# EAGLE design gamingpack (EAGLE 5.10)

## Sheet 1 of 2
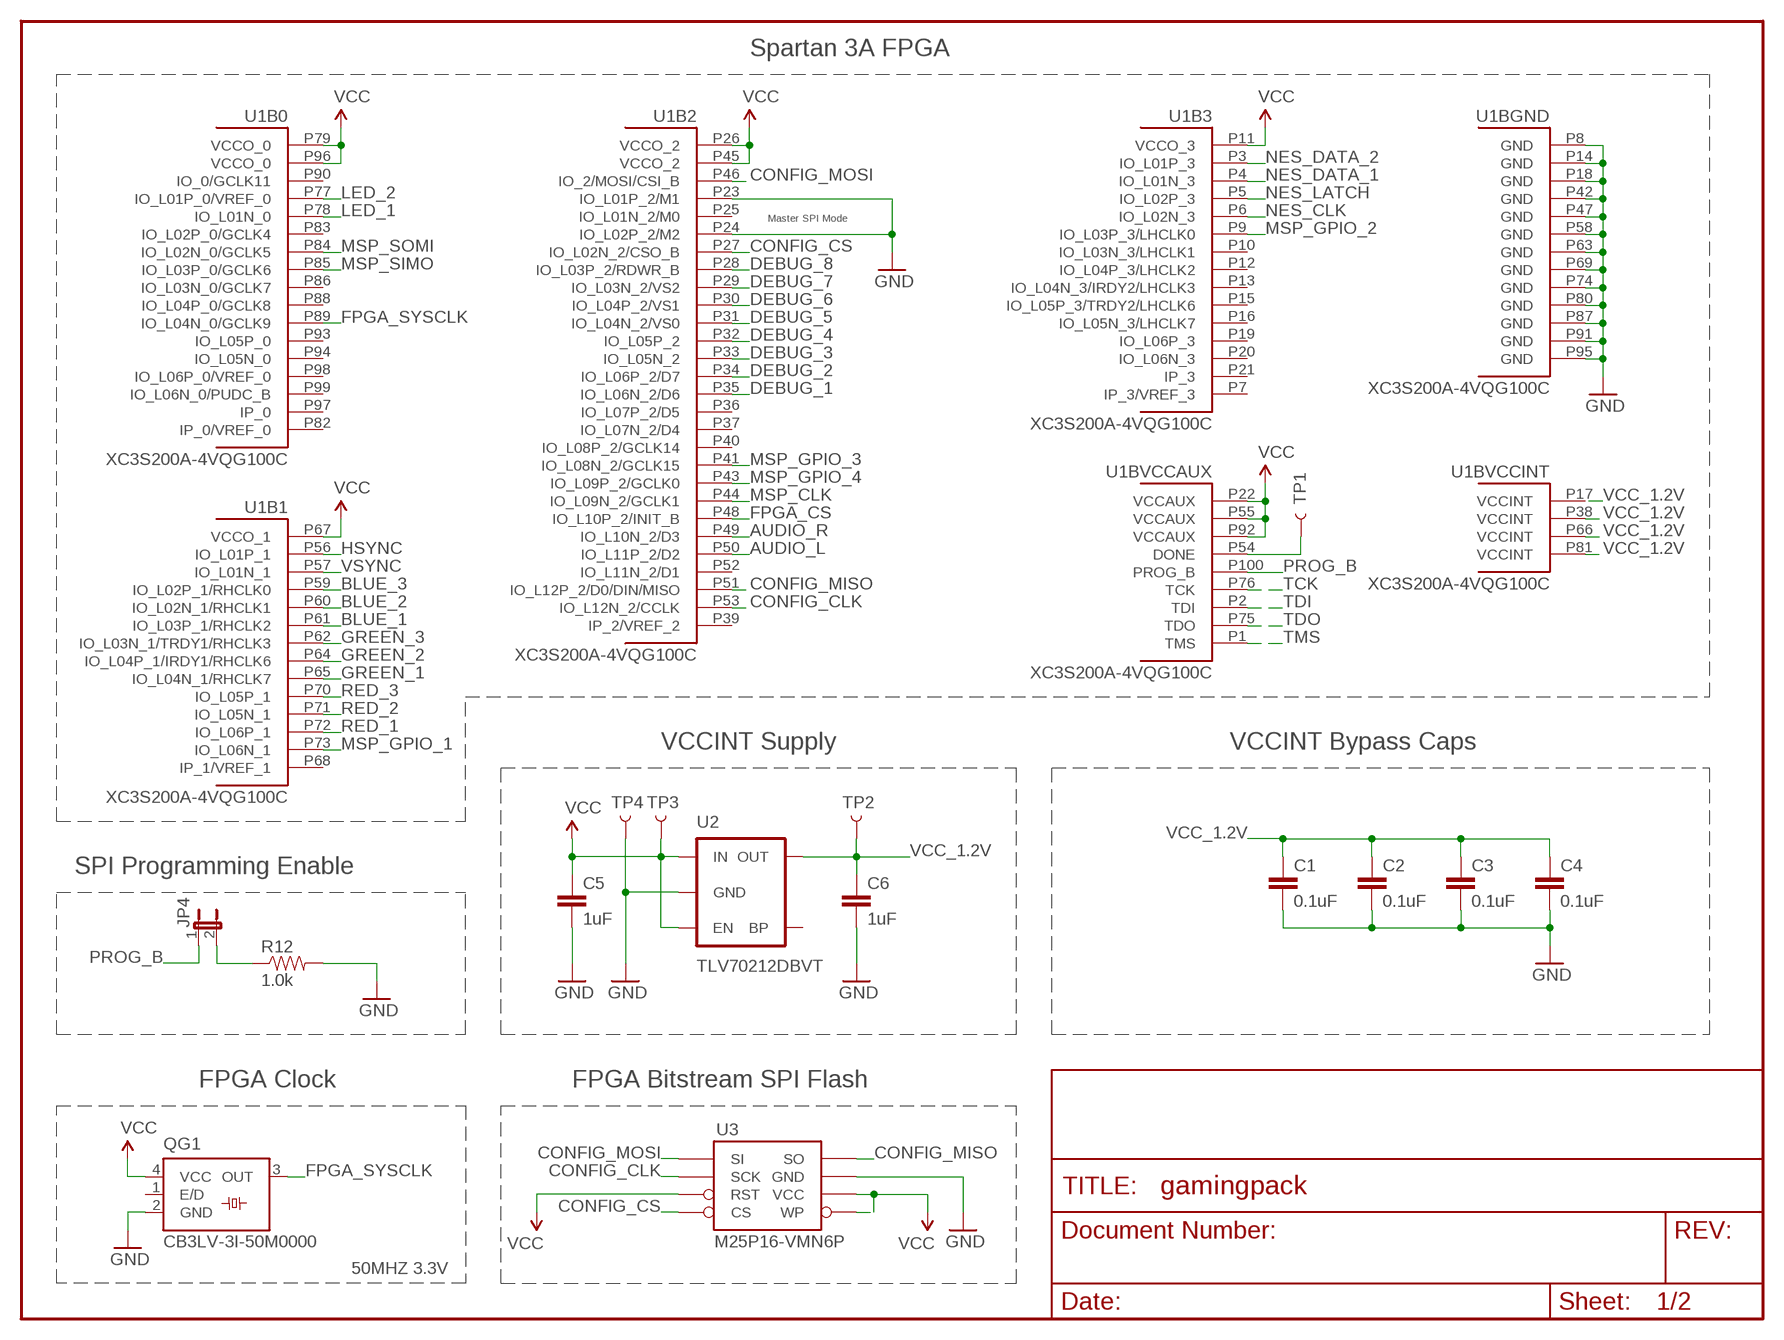
[diagram p0: schematic, sheet 1]

### Parts
C1  0.1uF  CAP0603-CAP  [0603-CAP]
C2  0.1uF  CAP0603-CAP  [0603-CAP]
C3  0.1uF  CAP0603-CAP  [0603-CAP]
C4  0.1uF  CAP0603-CAP  [0603-CAP]
C5  1uF  CAP0603-CAP  [0603-CAP]
C6  1uF  CAP0603-CAP  [0603-CAP]
JP4  JUMPER-2PTH  [1X02]
QG1  CB3LV-3I-50M0000  SM77H  [SM77H]
R12  1.0k  RESISTOR0805-RES  [0805]
TP1  TEST-POINT3  [PAD.03X.03]
TP2  TEST-POINT3  [PAD.03X.03]
TP3  TEST-POINT3  [PAD.03X.03]
TP4  TEST-POINT3  [PAD.03X.03]
U1  XC3S200A-4VQG100C  XC3S200AVQ100  [VQ100]
U2  TLV70212DBVT  V_REG_LDOSMD  [SOT23-5]
U3  M25P16-VMN6P  M25PXNARROW  [SO08]

### Nets
AUDIO_L: U1.P50(B2:IO_L11P_2/D2) ; also sheet 2
AUDIO_R: U1.P49(B2:IO_L10N_2/D3) ; also sheet 2
BLUE_1: U1.P61(B1:IO_L03P_1/RHCLK2) ; also sheet 2
BLUE_2: U1.P60(B1:IO_L02N_1/RHCLK1) ; also sheet 2
BLUE_3: U1.P59(B1:IO_L02P_1/RHCLK0) ; also sheet 2
CONFIG_CLK: U1.P53(B2:IO_L12N_2/CCLK) U3.6(SCK) ; also sheet 2
CONFIG_CS: U1.P27(B2:IO_L02N_2/CSO_B) U3.1(CS) ; also sheet 2
CONFIG_MISO: U1.P51(B2:IO_L12P_2/D0/DIN/MISO) U3.2(SO) ; also sheet 2
CONFIG_MOSI: U1.P46(B2:IO_2/MOSI/CSI_B) U3.5(SI) ; also sheet 2
DEBUG_1: U1.P35(B2:IO_L06N_2/D6) ; also sheet 2
DEBUG_2: U1.P34(B2:IO_L06P_2/D7) ; also sheet 2
DEBUG_3: U1.P33(B2:IO_L05N_2) ; also sheet 2
DEBUG_4: U1.P32(B2:IO_L05P_2) ; also sheet 2
DEBUG_5: U1.P31(B2:IO_L04N_2/VS0) ; also sheet 2
DEBUG_6: U1.P30(B2:IO_L04P_2/VS1) ; also sheet 2
DEBUG_7: U1.P29(B2:IO_L03N_2/VS2) ; also sheet 2
DEBUG_8: U1.P28(B2:IO_L03P_2/RDWR_B) ; also sheet 2
FPGA_CS: U1.P48(B2:IO_L10P_2/INIT_B) ; also sheet 2
FPGA_SYSCLK: QG1.3(OUT) U1.P89(B0:IO_L04N_0/GCLK9)
GND: C1.2 C2.2 C3.2 C4.2 C5.2 C6.2 QG1.2(GND) R12.2 TP4.P$1 U1.P8(BGND:GND) U1.P14(BGND:GND) U1.P18(BGND:GND) U1.P23(B2:IO_L01P_2/M1) U1.P24(B2:IO_L02P_2/M2) U1.P42(BGND:GND) U1.P47(BGND:GND) U1.P58(BGND:GND) U1.P63(BGND:GND) U1.P69(BGND:GND) U1.P74(BGND:GND) U1.P80(BGND:GND) U1.P87(BGND:GND) U1.P91(BGND:GND) U1.P95(BGND:GND) U2.2(GND) U3.4(GND) ; also sheet 2
GREEN_1: U1.P65(B1:IO_L04N_1/RHCLK7) ; also sheet 2
GREEN_2: U1.P64(B1:IO_L04P_1/IRDY1/RHCLK6) ; also sheet 2
GREEN_3: U1.P62(B1:IO_L03N_1/TRDY1/RHCLK3) ; also sheet 2
HSYNC: U1.P56(B1:IO_L01P_1) ; also sheet 2
LED_1: U1.P78(B0:IO_L01N_0) ; also sheet 2
LED_2: U1.P77(B0:IO_L01P_0/VREF_0) ; also sheet 2
MSP_CLK: U1.P44(B2:IO_L09N_2/GCLK1) ; also sheet 2
MSP_GPIO_1: U1.P73(B1:IO_L06N_1) ; also sheet 2
MSP_GPIO_2: U1.P9(B3:IO_L03P_3/LHCLK0) ; also sheet 2
MSP_GPIO_3: U1.P41(B2:IO_L08N_2/GCLK15) ; also sheet 2
MSP_GPIO_4: U1.P43(B2:IO_L09P_2/GCLK0) ; also sheet 2
MSP_SIMO: U1.P85(B0:IO_L03P_0/GCLK6) ; also sheet 2
MSP_SOMI: U1.P84(B0:IO_L02N_0/GCLK5) ; also sheet 2
N$7: JP4.2 R12.1
N$11: TP1.P$1 U1.P54(BVCCAUX:DONE)
NES_CLK: U1.P6(B3:IO_L02N_3) ; also sheet 2
NES_DATA_1: U1.P4(B3:IO_L01N_3) ; also sheet 2
NES_DATA_2: U1.P3(B3:IO_L01P_3) ; also sheet 2
NES_LATCH: U1.P5(B3:IO_L02P_3) ; also sheet 2
PROG_B: JP4.1 U1.P100(BVCCAUX:PROG_B)
RED_1: U1.P72(B1:IO_L06P_1) ; also sheet 2
RED_2: U1.P71(B1:IO_L05N_1) ; also sheet 2
RED_3: U1.P70(B1:IO_L05P_1) ; also sheet 2
TCK: U1.P76(BVCCAUX:TCK) ; also sheet 2
TDI: U1.P2(BVCCAUX:TDI) ; also sheet 2
TDO: U1.P75(BVCCAUX:TDO) ; also sheet 2
TMS: U1.P1(BVCCAUX:TMS) ; also sheet 2
VCC: C5.1 QG1.4(VCC) TP3.P$1 U1.P11(B3:VCCO_3) U1.P22(BVCCAUX:VCCAUX) U1.P26(B2:VCCO_2) U1.P45(B2:VCCO_2) U1.P55(BVCCAUX:VCCAUX) U1.P67(B1:VCCO_1) U1.P79(B0:VCCO_0) U1.P92(BVCCAUX:VCCAUX) U1.P96(B0:VCCO_0) U2.1(IN) U2.3(EN) U3.3(WP) U3.7(RST) U3.8(VCC) ; also sheet 2
VCC_1.2V: C1.1 C2.1 C3.1 C4.1 C6.1 TP2.P$1 U1.P17(BVCCINT:VCCINT) U1.P38(BVCCINT:VCCINT) U1.P66(BVCCINT:VCCINT) U1.P81(BVCCINT:VCCINT) U2.5(OUT)
VSYNC: U1.P57(B1:IO_L01N_1) ; also sheet 2
Unconnected: QG1.1(E/D) U1.P7(B3:IP_3/VREF_3) U1.P10(B3:IO_L03N_3/LHCLK1) U1.P12(B3:IO_L04P_3/LHCLK2) U1.P13(B3:IO_L04N_3/IRDY2/LHCLK3) U1.P15(B3:IO_L05P_3/TRDY2/LHCLK6) U1.P16(B3:IO_L05N_3/LHCLK7) U1.P19(B3:IO_L06P_3) U1.P20(B3:IO_L06N_3) U1.P21(B3:IP_3) U1.P25(B2:IO_L01N_2/M0) U1.P36(B2:IO_L07P_2/D5) U1.P37(B2:IO_L07N_2/D4) U1.P39(B2:IP_2/VREF_2) U1.P40(B2:IO_L08P_2/GCLK14) U1.P52(B2:IO_L11N_2/D1) U1.P68(B1:IP_1/VREF_1) U1.P82(B0:IP_0/VREF_0) U1.P83(B0:IO_L02P_0/GCLK4) U1.P86(B0:IO_L03N_0/GCLK7) U1.P88(B0:IO_L04P_0/GCLK8) U1.P90(B0:IO_0/GCLK11) U1.P93(B0:IO_L05P_0) U1.P94(B0:IO_L05N_0) U1.P97(B0:IP_0) U1.P98(B0:IO_L06P_0/VREF_0) U1.P99(B0:IO_L06N_0/PUDC_B) U2.4(BP)

### Notes on the sheet
- Spartan 3A FPGA
- Master SPI Mode
- VCCINT Supply | VCCINT Bypass Caps
- SPI Programming Enable
- FPGA Clock | FPGA Bitstream SPI Flash
- M25P16-VMN6P
- 50MHZ 3.3V

## Sheet 2 of 2
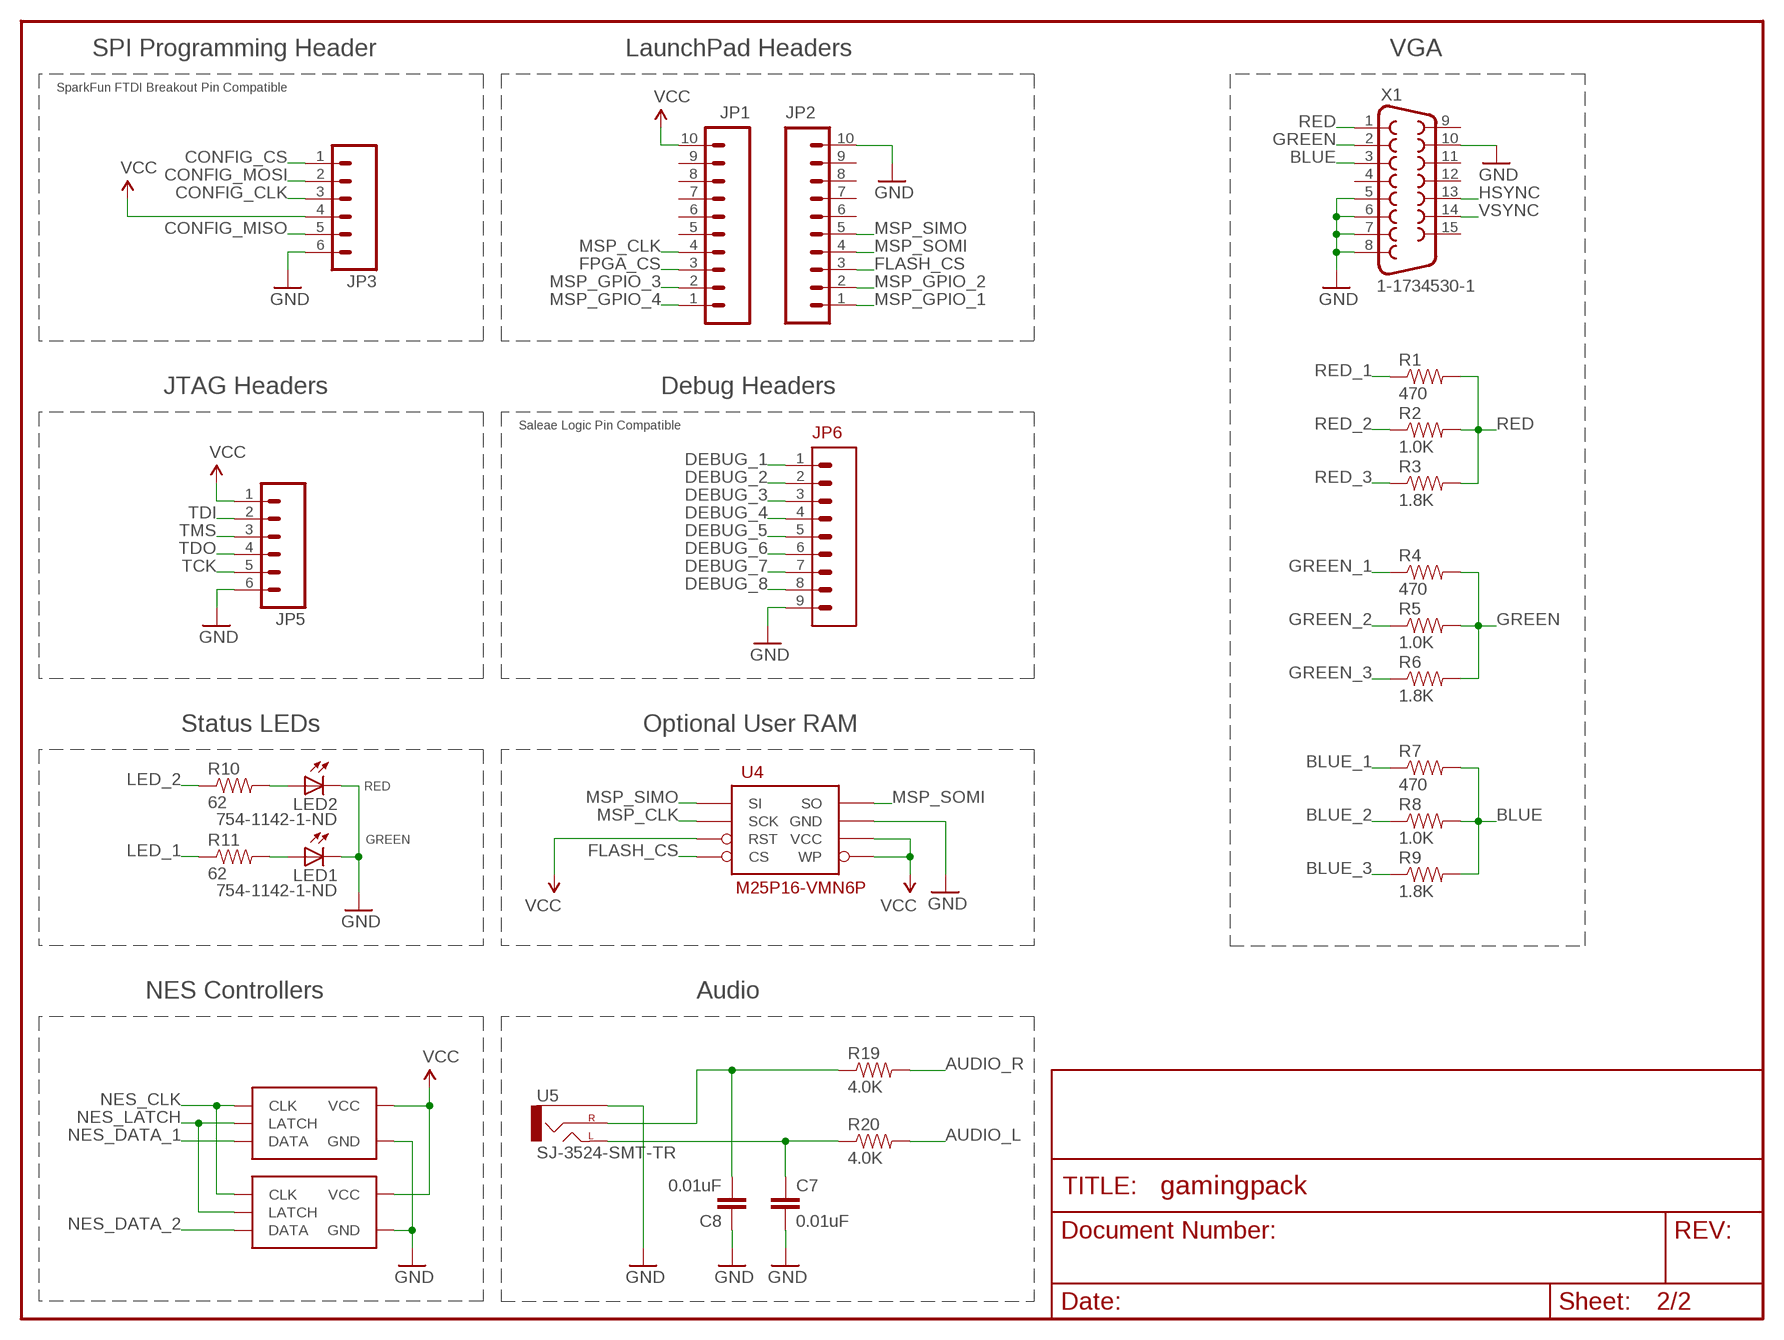
[diagram p1: schematic, sheet 2]

### Parts
C7  0.01uF  CAP0603-CAP  [0603-CAP]
C8  0.01uF  CAP0603-CAP  [0603-CAP]
JP1  M10"  [1X10]
JP2  M10"  [1X10]
JP3  M06SIP  [1X06]
JP5  M06SIP  [1X06]
JP6  M09_SMD  [1X09-SMD]
LED1  754-1142-1-ND  LED1206  [LED-1206]
LED2  754-1142-1-ND  LED1206  [LED-1206]
R1  470  RESISTOR0805-RES  [0805]
R2  1.0K  RESISTOR0805-RES  [0805]
R3  1.8K  RESISTOR0805-RES  [0805]
R4  470  RESISTOR0805-RES  [0805]
R5  1.0K  RESISTOR0805-RES  [0805]
R6  1.8K  RESISTOR0805-RES  [0805]
R7  470  RESISTOR0805-RES  [0805]
R8  1.0K  RESISTOR0805-RES  [0805]
R9  1.8K  RESISTOR0805-RES  [0805]
R10  62  RESISTOR0805-RES  [0805]
R11  62  RESISTOR0805-RES  [0805]
R19  4.0K  RESISTOR0805-RES  [0805]
R20  4.0K  RESISTOR0805-RES  [0805]
U4  M25P16-VMN6P  M25PXNARROW  [SO08]
U5  SJ-3524-SMT-TR  AUDIO-JACKSMD2  [AUDIO-JACK-3.5MM-SMD]
U$2  NES_CONTROLLER  [NES_CONTROLLER]
U$3  NES_CONTROLLER  [NES_CONTROLLER]
X1  1-1734530-1  F15HDH  [HDF15H]

### Nets
AUDIO_L: R20.2 ; also sheet 1
AUDIO_R: R19.2 ; also sheet 1
BLUE: R7.2 R8.2 R9.2 X1.3
BLUE_1: R7.1 ; also sheet 1
BLUE_2: R8.1 ; also sheet 1
BLUE_3: R9.1 ; also sheet 1
CONFIG_CLK: JP3.3 ; also sheet 1
CONFIG_CS: JP3.1 ; also sheet 1
CONFIG_MISO: JP3.5 ; also sheet 1
CONFIG_MOSI: JP3.2 ; also sheet 1
DEBUG_1: JP6.1 ; also sheet 1
DEBUG_2: JP6.2 ; also sheet 1
DEBUG_3: JP6.3 ; also sheet 1
DEBUG_4: JP6.4 ; also sheet 1
DEBUG_5: JP6.5 ; also sheet 1
DEBUG_6: JP6.6 ; also sheet 1
DEBUG_7: JP6.7 ; also sheet 1
DEBUG_8: JP6.8 ; also sheet 1
FLASH_CS: JP2.3 U4.1(CS)
FPGA_CS: JP1.3 ; also sheet 1
GND: C7.2 C8.1 JP2.10 JP3.6 JP5.6 JP6.9 LED1.C LED2.C U4.4(GND) U5.SLEEVE U$2.P$1(GND) U$3.P$1(GND) X1.5 X1.6 X1.7 X1.8 X1.10 ; also sheet 1
GREEN: R4.2 R5.2 R6.2 X1.2
GREEN_1: R4.1 ; also sheet 1
GREEN_2: R5.1 ; also sheet 1
GREEN_3: R6.1 ; also sheet 1
HSYNC: X1.13 ; also sheet 1
LED_1: R11.1 ; also sheet 1
LED_2: R10.1 ; also sheet 1
MSP_CLK: JP1.4 U4.6(SCK) ; also sheet 1
MSP_GPIO_1: JP2.1 ; also sheet 1
MSP_GPIO_2: JP2.2 ; also sheet 1
MSP_GPIO_3: JP1.2 ; also sheet 1
MSP_GPIO_4: JP1.1 ; also sheet 1
MSP_SIMO: JP2.5 U4.5(SI) ; also sheet 1
MSP_SOMI: JP2.4 U4.2(SO) ; also sheet 1
N$1: LED2.A R10.2
N$2: LED1.A R11.2
N$5: C8.2 R19.1 U5.RING(RIGHT)
N$19: C7.1 R20.1 U5.TIP(LEFT)
NES_CLK: U$2.P$2(CLK) U$3.P$2(CLK) ; also sheet 1
NES_DATA_1: U$2.P$4(DATA) ; also sheet 1
NES_DATA_2: U$3.P$4(DATA) ; also sheet 1
NES_LATCH: U$2.P$3(LATCH) U$3.P$3(LATCH) ; also sheet 1
RED: R1.2 R2.2 R3.2 X1.1
RED_1: R1.1 ; also sheet 1
RED_2: R2.1 ; also sheet 1
RED_3: R3.1 ; also sheet 1
TCK: JP5.5 ; also sheet 1
TDI: JP5.2 ; also sheet 1
TDO: JP5.4 ; also sheet 1
TMS: JP5.3 ; also sheet 1
VCC: JP1.10 JP3.4 JP5.1 U4.3(WP) U4.7(RST) U4.8(VCC) U$2.P$7(VCC) U$3.P$7(VCC) ; also sheet 1
VSYNC: X1.14 ; also sheet 1
Unconnected: JP1.5 JP1.6 JP1.7 JP1.8 JP1.9 JP2.6 JP2.7 JP2.8 JP2.9 X1.4 X1.9 X1.11 X1.12 X1.15

### Notes on the sheet
- SPI Programming Header | LaunchPad Headers | VGA
- SparkFun FTDI Breakout Pin Compatible
- JTAG Headers | Debug Headers
- Saleae Logic Pin Compatible
- Status LEDs | Optional User RAM
- RED
- GREEN
- NES Controllers | Audio

## Library data of the parts
C1-C8 = SparkFun:CAP: Capacitor Standard 0603 ceramic capacitor, and 0.1" leaded capacitor.
JP1 JP2 = SparkFun:M10: Header 10 Standard 10-pin 0.1" header. Use with straight break away headers (SKU : PRT-00116), right angle break away headers (PRT-00553), swiss pins (PRT-00743), machine pins (PRT-00117), and female headers (PRT-00115).
JP3 JP5 = SparkFun:M06: Header 6 Standard 6-pin 0.1" header. Use with straight break away headers (SKU : PRT-00116), right angle break away headers (PRT-00553), swiss pins (PRT-00743), machine pins (PRT-00117), and female headers (PRT-00115). Molex polarized connector foot print use with SKU : PRT-08094 with associated crimp pins and housings. NOTES ON THE VARIANTS LOCK and LOCK_LONGPADS... This footprint was designed to help hold the alignment of a through-hole component (i.e. 6-pin header) while soldering it into place. You may notice that each hole has been shifted either up or down by 0.005 of an inch from it's more standard position (which is a perfectly straight line). This slight alteration caused the pins (the squares in the middle) to touch the edges of the holes. Because they are alternating, it causes a "brace" to hold the component in place. 0.005 has proven to be the perfect amount of "off-center" position when using our standard breakaway headers. Although looks a little odd when you look at the bare footprint, once you have a header in there, the alteration is very hard to notice. Also, if you push a header all the way into place, it is covered up entirely on the bottom side. This idea of altering the position of holes to aid alignment will be further integrated into the Sparkfun Library for other footprints. It can help hold any component with 3 or more connection pins.
JP4 = SparkFun:JUMPER-2: Jumper Basic 0.1" spaced jumper. Use with breakaway headers.
JP6 = smd_pin_headers:M09_SMD
LED1 LED2 = SparkFun:LED: LEDs Standard schematic elements and footprints for 5mm, 3mm, 1206, and 0603 sized LEDs. 5mm - Spark Fun Electronics SKU : COM-00529 (and others)
QG1 = crystal:SM77H: 3.3V CMOS Clock Oscillator Source: www.pletronics.com .. sm77h%203.3v.pdf
R1-R12 R19 R20 = SparkFun:RESISTOR: Resistor Basic schematic elements and footprints for 0603, 1206, and PTH resistors.
TP1-TP4 = SparkFun:TEST-POINT
U1 = xilinx_devices:XC3S200AVQ100: Xilinx FPGA: XC3S200AVQ100
U2 = SparkFun:V_REG_LDO: Voltage Regulator LDO Standard 150mA LDO voltage regulator in SOT-23 layout. Micrel part MIC5205. BP (by-pass) pin is used to lower output noise with 470pF cap.
U3 U4 = m25p_spi_prom:M25PX
U5 = SparkFun:AUDIO-JACK: 3.5mm Audio Jack Simple 3.5mm common PCB mount audio jack. SKU: PRT-08032
U$2 U$3 = nes_controller:NES_CONTROLLER
X1 = db15_connectors:F15: SUB-D HDH is also known as a right angle VGA' connector'

## Board
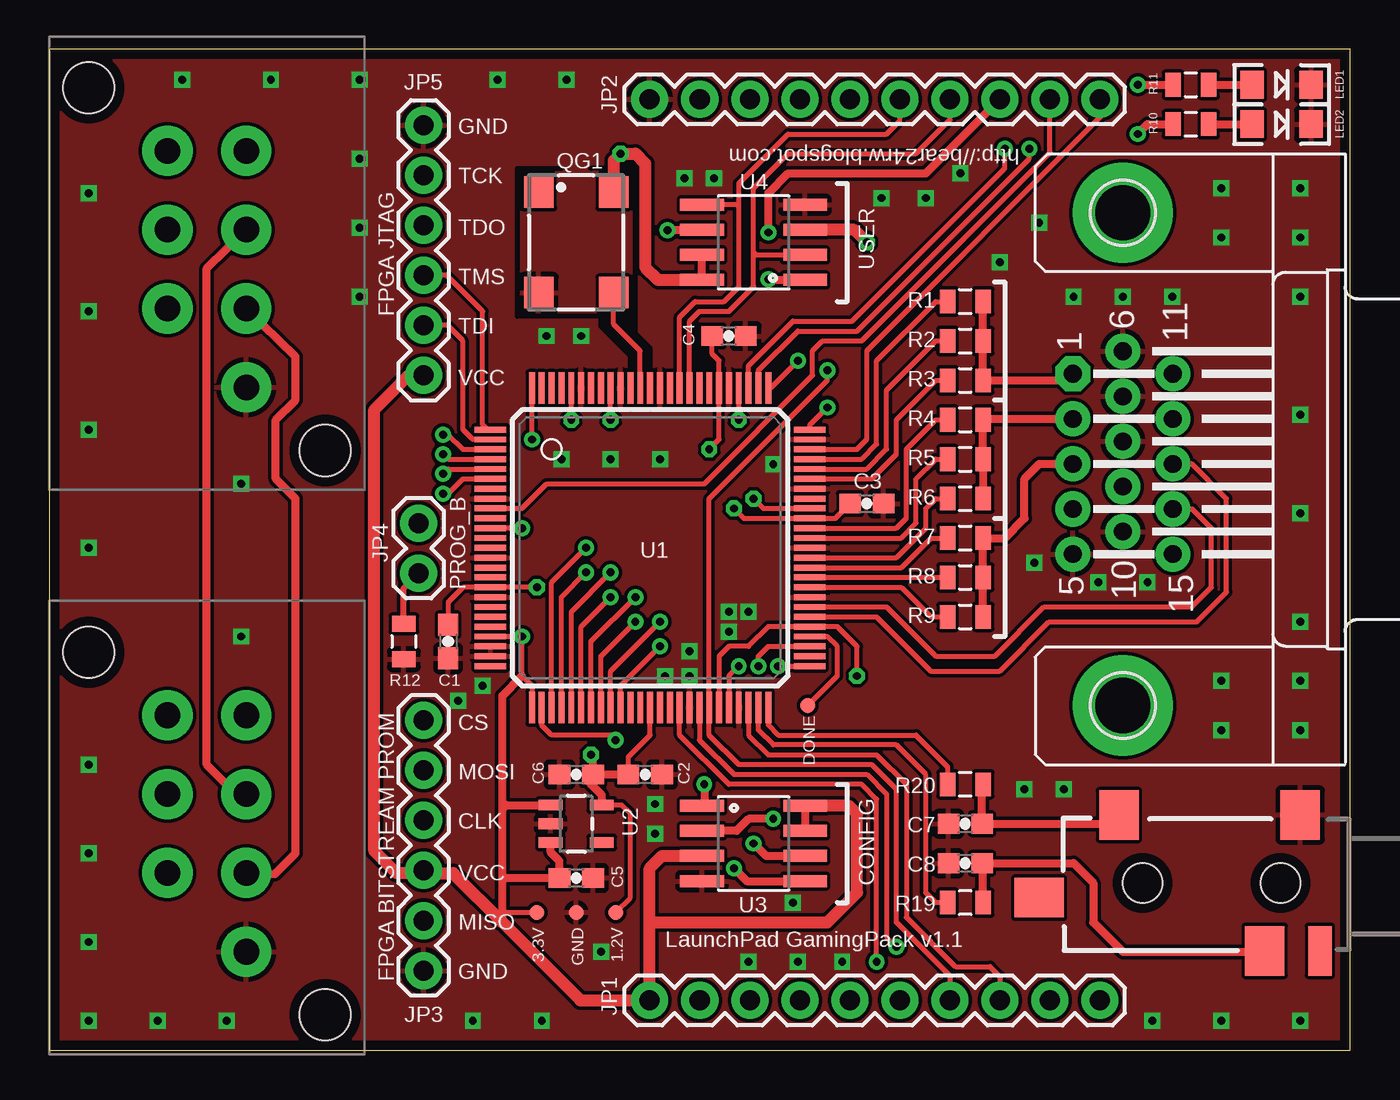
[diagram p2: board, top side]
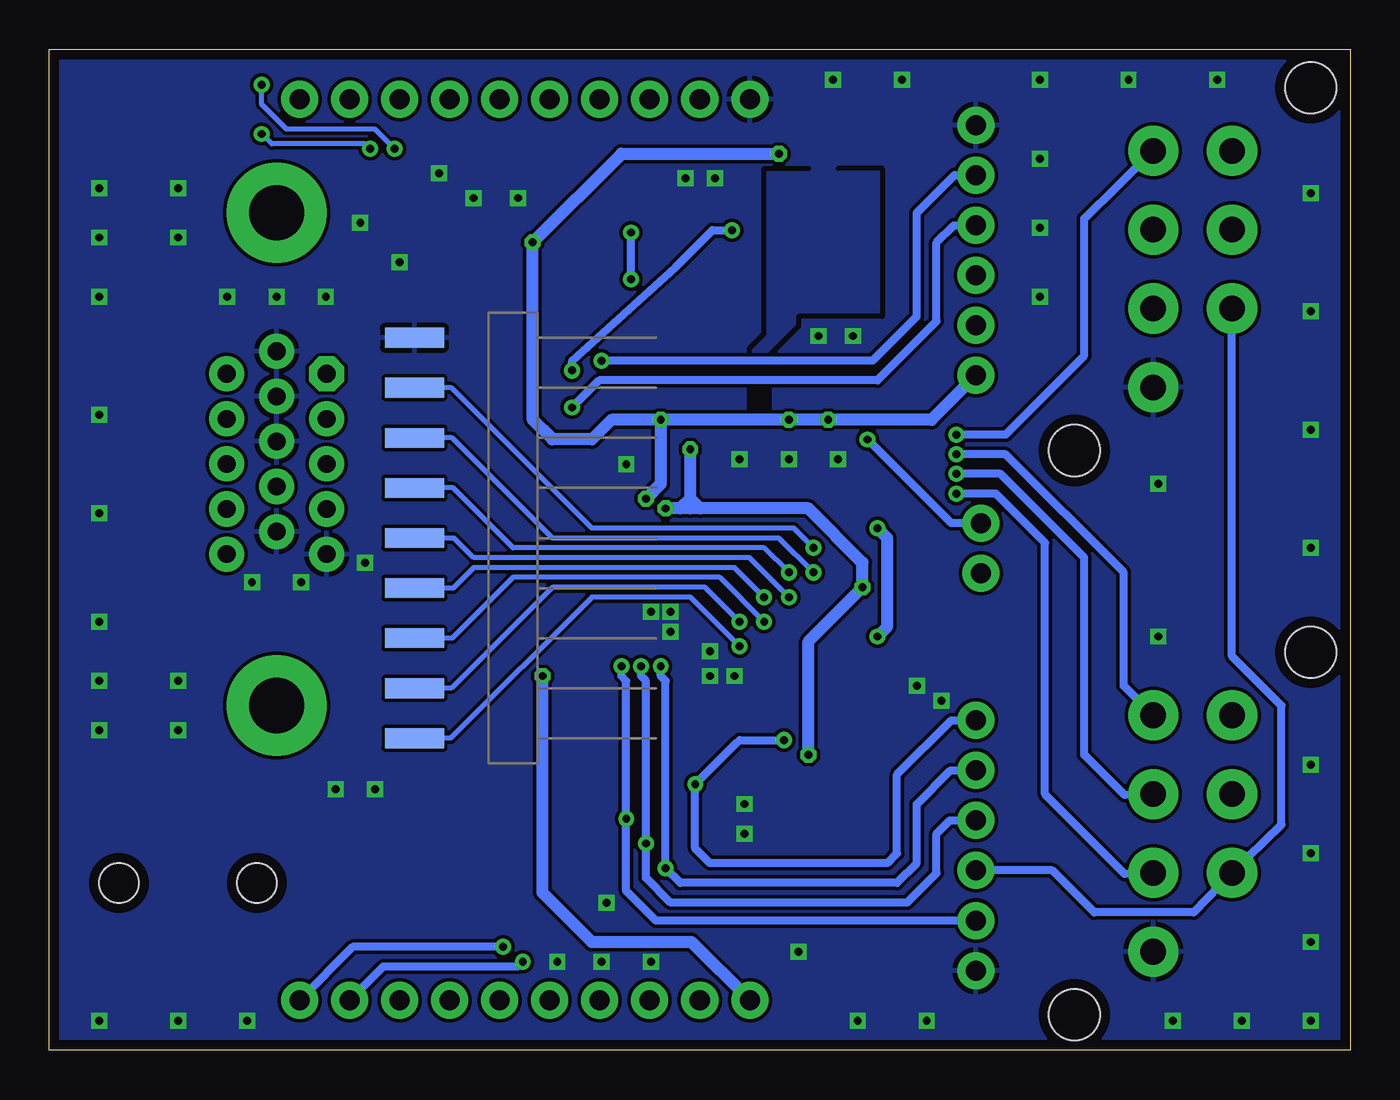
[diagram p3: board, bottom side, seen from below]

Size 66.04 x 50.8 mm. Coordinates in mm from the lower left corner, seen from the top.
Outline: 0,0 66.04,0 66.04,50.8 0,50.8 0,0
Copper layers (1*16): Top 0.0356mm / dielectric 1.5011mm / Bottom 0.0356mm
Design rules "SilverCircuits_tented": minimum track width 7mil, minimum drill 14mil, track to track 7mil, track to pad 7mil, pad to pad 7mil, via to via 7mil, smd to smd 0mil, copper to edge 20mil, drill to drill 8mil, minimum pad ring 10mil, minimum via ring 8mil, stop-mask expansion 4mil, vias tented up to drill 17mil, thermal gap 10mil
tRestrict: 11 lines
bRestrict: 11 lines

### Footprints (pad centres in the part's own frame; a part is rotated, then mirrored left to right if it is on the bottom)
0603-CAP = smd 1.1 x 1: 1 -0.85,0; 2 0.85,0
1X10 = drill 1.016 pad 1.88 round: 1 0,0; 2 2.54,0; 3 5.08,0; 4 7.62,0; 5 10.16,0; 6 12.7,0; 7 15.24,0; 8 17.78,0; 9 20.32,0; 10 22.86,0
1X06 = drill 1.016 pad 1.88 round: 1 0,0; 2 2.54,0; 3 5.08,0; 4 7.62,0; 5 10.16,0; 6 12.7,0
1X02 = drill 1.016 pad 1.88 round: 1 0,0; 2 2.54,0
1X09-SMD = smd 1 x 3: 1 -10.16,5; 2 -7.62,5; 3 -5.08,5; 4 -2.54,5; 5 0,5; 6 2.54,5; 7 5.08,5; 8 7.62,5; 9 10.16,5
LED-1206 = smd 1.2 x 1.4: A -1.5,0; C 1.5,0
SM77H = smd 1.6 x 1.5: 1 -2.55,-1.9; 2 2.55,-1.9; 3 2.55,1.9; 4 -2.55,1.9
0805 = smd 0.8 x 1.2: 1 -0.9,0; 2 0.9,0
PAD.03X.03 = smd 0.762 x 0.762: P$1 0,0
VQ100 = smd 1.6 x 0.3: P1 -8.1,6; P2 -8.1,5.5; P3 -8.1,5; P4 -8.1,4.5; P5 -8.1,4; P6 -8.1,3.5; P7 -8.1,3; P8 -8.1,2.5; P9 -8.1,2; P10 -8.1,1.5; P11 -8.1,1; P12 -8.1,0.5; P13 -8.1,0; P14 -8.1,-0.5; P15 -8.1,-1; P16 -8.1,-1.5; P17 -8.1,-2; P18 -8.1,-2.5; P19 -8.1,-3; P20 -8.1,-3.5; P21 -8.1,-4; P22 -8.1,-4.5; P23 -8.1,-5; P24 -8.1,-5.5; P25 -8.1,-6; P51 8.1,-6; P52 8.1,-5.5; P53 8.1,-5; P54 8.1,-4.5; P55 8.1,-4; P56 8.1,-3.5; P57 8.1,-3; P58 8.1,-2.5; P59 8.1,-2; P60 8.1,-1.5; P61 8.1,-1; P62 8.1,-0.5; P63 8.1,0; P64 8.1,0.5; P65 8.1,1; P66 8.1,1.5; P67 8.1,2; P68 8.1,2.5; P69 8.1,3; P70 8.1,3.5; P71 8.1,4; P72 8.1,4.5; P73 8.1,5; P74 8.1,5.5; P75 8.1,6 | smd 0.3 x 1.6: P26 -6,-8.1; P27 -5.5,-8.1; P28 -5,-8.1; P29 -4.5,-8.1; P30 -4,-8.1; P31 -3.5,-8.1; P32 -3,-8.1; P33 -2.5,-8.1; P34 -2,-8.1; P35 -1.5,-8.1; P36 -1,-8.1; P37 -0.5,-8.1; P38 0,-8.1; P39 0.5,-8.1; P40 1,-8.1; P41 1.5,-8.1; P42 2,-8.1; P43 2.5,-8.1; P44 3,-8.1; P45 3.5,-8.1; P46 4,-8.1; P47 4.5,-8.1; P48 5,-8.1; P49 5.5,-8.1; P50 6,-8.1; P76 6,8.1; P77 5.5,8.1; P78 5,8.1; P79 4.5,8.1; P80 4,8.1; P81 3.5,8.1; P82 3,8.1; P83 2.5,8.1; P84 2,8.1; P85 1.5,8.1; P86 1,8.1; P87 0.5,8.1; P88 0,8.1; P89 -0.5,8.1; P90 -1,8.1; P91 -1.5,8.1; P92 -2,8.1; P93 -2.5,8.1; P94 -3,8.1; P95 -3.5,8.1; P96 -4,8.1; P97 -4.5,8.1; P98 -5,8.1; P99 -5.5,8.1; P100 -6,8.1
SOT23-5 = smd 0.55 x 1.2: 1 -0.95,-1.3; 2 0,-1.3; 3 0.95,-1.3; 4 0.95,1.3; 5 -0.95,1.3
SO08 = smd 0.61 x 2.21: 1 -1.905,-2.616; 2 -0.635,-2.616; 3 0.635,-2.616; 4 1.905,-2.616; 5 1.905,2.616; 6 0.635,2.616; 7 -0.635,2.616; 8 -1.905,2.616
AUDIO-JACK-3.5MM-SMD = smd 2 x 2.5: RING 4.3,3.45; SLEEVE 2.5,-3.45; TIP 11.7,-3.45 | smd 1.2 x 2.5: RSH 1.5,3.45 | smd 2.5 x 2: TSH 15.75,0.75 | hole 2: 3.5,0; 10.5,0
NES_CONTROLLER = drill 1.3 pad 2.54 round: P$1 4,-3.2; P$2 4,-7.2; P$3 4,-11.2; P$4 4,-15.2; P$5 8,-15.2; P$6 8,-11.2; P$7 8,-7.2 | hole 2.6: 0,0; 12,-18.4
HDF15H = drill 0.9 pad 1.778 octagon: 1 4.329,2.54 | drill 0.9 pad 1.778 round: 2 2.043,2.54; 3 -0.243,2.54; 4 -2.529,2.54; 5 -4.815,2.54; 6 5.472,0; 7 3.186,0; 8 0.9,0; 9 -1.386,0; 10 -3.672,0; 11 4.329,-2.54; 12 2.043,-2.54; 13 -0.243,-2.54; 14 -2.529,-2.54; 15 -4.815,-2.54 | drill 2.8 pad 5.08 round: P$1 -12.5,0; P$2 12.5,0

### Placement (x,y rotation side)
C1  20.25,20.75 270 top
C2  30.25,14 0 top
C3  41.5,27.75 0 top
C4  34.5,36.25 0 top
C5  26.75,8.75 0 top
C6  26.75,14 180 top
C7  46.5,11.5 180 top
C8  46.5,9.5 0 top
JP1  53.34,2.54 180 top
JP2  53.34,48.26 180 top
JP3  19,16.75 270 top
JP4  18.75,26.75 270 top
JP5  19,34.25 90 top
JP6  42.5,26 90 bottom
LED1  62.55,49 0 top
LED2  62.55,47 0 top
QG1  26.75,41 270 top
R1  46.5,38 0 top
R2  46.5,36 0 top
R3  46.5,34 0 top
R4  46.5,32 0 top
R5  46.5,30 0 top
R6  46.5,28 0 top
R7  46.5,26 0 top
R8  46.5,24 0 top
R9  46.5,22 0 top
R10  57.95,47 0 top
R11  57.95,49 0 top
R12  18,20.75 270 top
R19  46.5,7.5 180 top
R20  46.5,13.5 180 top
TP1  38.5,17.5 0 top
TP2  28.75,7 0 top
TP3  24.75,7 0 top
TP4  26.75,7 0 top
U1  30.5,25.5 0 top
U2  26.75,11.5 270 top
U3  35.75,10.5 270 top
U4  35.75,41 90 top
U5  66,8.5 180 top
U$2  14,1.8 180 top
U$3  14,30.45 180 top
X1  54.5,30 90 top

### Tracks (layer width: path | path; a pad name or v marks a point on that pad's centre or on a via)
AUDIO_L
  Top 0.254: U1.P50 36.5,16.5 37,16 44,16 45.6,14.4 R20.2
AUDIO_R
  Top 0.254: U1.P49 36,16.25 36.75,15.5 43,15.5 44.5,14 44.5,8 45,7.5 R19.2
BLUE
  Top 0.406: R9.2 R8.2 R7.2 48.5,26 49.5,27 49.5,29 50.26,29.76 X1.3
BLUE_1
  Top 0.254: R7.1 44.75,26 43.25,24.5 U1.P61
BLUE_2
  Top 0.254: U1.P60 R8.1
BLUE_3
  Top 0.254: R9.1 44.75,22 43.25,23.5 U1.P59
CONFIG_CLK  (via drill 0.4)
  Top 0.254: U1.P53 36.5,20.5 36,20 v36,19.5
  Top 0.406: U3.6 36.38,9.87 v35.75,10.5
  Bottom 0.406: JP3.3 20.33,11.67 21,11 21,9 22.5,7.5 34.5,7.5 35.75,8.75 v35.75,10.5 35.75,18.75 36,19 v36,19.5
CONFIG_CS  (via drill 0.4, 0.41)
  Top 0.254: U1.P27 25,16.5 25.5,16 28.5,16 v28.75,15.75
  Top 0.406: v33.25,13.5 33.25,12.52 U3.1
  Bottom 0.406: JP3.1 20.25,16.75 23,14 23,10 23.5,9.5 32.5,9.5 33.25,10.25 v33.25,13.5 31.12,15.62 31,15.75 v28.75,15.75
CONFIG_MISO  (via drill 0.4)
  Top 0.254: v37,19.5 U1.P51
  Top 0.406: U3.2 34.88,11.13 35.5,11.75 v36.75,11.75
  Bottom 0.406: JP3.5 35.25,6.59 36.75,8.09 v36.75,11.75 36.75,18.75 37,19 v37,19.5
CONFIG_MOSI  (via drill 0.4)
  Top 0.254: U1.P46 34.5,19 v35,19.5
  Top 0.406: U3.5 35.41,8.6 v34.75,9.25
  Bottom 0.406: JP3.2 20.29,14.21 22,12.5 22,9.5 23,8.5 34,8.5 v34.75,9.25 34.75,18.75 35,19 v35,19.5
DEBUG_1  (via drill 0.4)
  Top 0.254: U1.P35 29,18.5 v31,20.5
  Bottom 0.254: JP6.1 45.66,15.84 38.5,23 33.5,23 v31,20.5
DEBUG_2  (via drill 0.4)
  Top 0.254: U1.P34 28.5,19.25 v31,21.75
  Bottom 0.254: JP6.2 45.62,18.38 40.5,23.5 32.75,23.5 v31,21.75
DEBUG_3  (via drill 0.4)
  Top 0.254: U1.P33 28,20 v29.75,21.75
  Bottom 0.254: JP6.3 45.58,20.92 42.5,24 32,24 v29.75,21.75
DEBUG_4  (via drill 0.41)
  Top 0.254: U1.P32 27.5,20.75 v29.75,23
  Bottom 0.254: 47.46,23.5 JP6.4 45.54,23.46 44.5,24.5 31.25,24.5 v29.75,23
DEBUG_5  (via drill 0.41)
  Top 0.254: U1.P31 27,21.5 v28.5,23
  Bottom 0.254: JP6.5 45.5,26 44.5,25 30.5,25 v28.5,23
DEBUG_6  (via drill 0.41)
  Top 0.254: U1.P30 26.5,22.25 v28.5,24.25
  Bottom 0.254: JP6.6 45.54,28.54 42.5,25.5 29.75,25.5 v28.5,24.25
DEBUG_7  (via drill 0.41)
  Top 0.254: U1.P29 26,23 v27.25,24.25
  Bottom 0.254: JP6.7 45.58,31.08 40.5,26 29,26 v27.25,24.25
DEBUG_8  (via drill 0.41)
  Top 0.254: U1.P28 25.5,23.75 v27.25,25.5
  Bottom 0.254: JP6.8 45.62,33.62 38.5,26.5 28.25,26.5 v27.25,25.5
FLASH_CS  (via drill 0.4)
  Top 0.406: JP2.3 44.5,44.5 37.5,44.5 36.5,43.5 v36.5,41.5 | U4.1 36.53,39.09 v36.5,39.12
  Bottom 0.406: v36.5,39.12 v36.5,41.5
FPGA_CS
  Top 0.254: U1.P48 35.5,16 36.5,15 42,15 43.5,13.5 43.5,6.75 46,4.25 47.75,4.25 48.26,3.74 JP1.3
FPGA_SYSCLK
  Top 0.254: U1.P89 30,35.5 28.65,36.85 QG1.3
GND  (via drill 0.4)
  other vias: 36.75,29.75 26,30 28.5,30 31,30 32.25,44.25 33.75,44.25 52,38.25 54.5,38.25 57,38.25 63.5,18.75 63.5,16.25 59.5,16.25 59.5,18.75 56,1.5 59.5,1.5 2,5.5 2,1.5 5.5,1.5 25,1.5 21.5,1.5 63.5,21.75 63.5,38.25 63.5,32.25 63.5,27.25 46.25,44.5 44.5,43.25 42.25,43.25 50.25,42 48.25,40 6.75,49.25 11.25,49.25 15.75,49.25 15.75,45.25 15.75,41.75 15.75,38.25 2,25.5 2,31.5 2,43.5 2,37.5 2,14.5 2,10 9.75,21 9.75,28.75 35.5,4.5 49.5,13.25 31.25,19 34.5,22.25 22,18.5 20.75,17.75 28,5 37.75,7.5 30.75,12.5 30.75,11 38,4.5 22.75,49.25 26.25,49.25 63.5,43.75 63.5,41.25 59.5,41.25 59.5,43.75 40.25,4.5 9,1.5 63.5,1.5 32.5,19 32.5,20.25 34.5,21.25 35.5,22.25 51.5,13.25 53.25,23.75 55.75,23.75 50,24.75 25.25,36.25 27,36.25
  pour Top: -2.54,53.34 69.85,53.34 69.85,-2.54 -2.54,-2.54
  pour Bottom: -1.27,52.07 68.58,52.07 68.58,-1.27 -1.27,-1.27
GREEN
  Top 0.254: R4.2 47.44,32.04
  Top 0.406: R4.2 R5.2 R6.2 | 47.44,32.04 X1.2
GREEN_1
  Top 0.254: R4.1 45,32 43.5,30.5 43.5,27 43,26.5 U1.P65
GREEN_2
  Top 0.254: R5.1 45,30 44,29 44,26.75 43.25,26 U1.P64
GREEN_3
  Top 0.254: R6.1 45,28 44.5,27.5 44.5,26.5 43,25 U1.P62
HSYNC
  Top 0.254: X1.13 57.99,29.76 59.75,28 59.75,23.25 58.25,21.75 50.75,21.75 48.25,19.25 44.75,19.25 42,22 U1.P56
LED_1  (via drill 0.4)
  Top 0.254: U1.P78 35.5,34.75 37.75,37 40.75,37 48.5,44.75 v48.5,45.75
  Top 0.406: v55.25,49 R11.1
  Bottom 0.254: v48.5,45.75 49.5,46.75 54,46.75 55.25,48 v55.25,49
LED_2  (via drill 0.4)
  Top 0.254: U1.P77 36,34.5 38,36.5 41,36.5 49.75,45.25 v49.75,45.75
  Top 0.406: R10.1 55.75,47 v55.25,46.5
  Bottom 0.254: v49.75,45.75 50,46 54.75,46 v55.25,46.5
MSP_CLK  (via drill 0.4, 0.41)
  Top 0.254: JP1.4 45.72,3.78 43,6.5 43,13.25 41.75,14.5 35,14.5 33.5,16 U1.P44 33.5,28 39.5,34 v39.5,34.5
  Top 0.406: U4.6 31.39,41.63 v31.38,41.62
  Bottom 0.406: v31.38,41.62 32.38,41.62 34.25,39.75 39.5,35 v39.5,34.5
MSP_GPIO_1
  Top 0.254: U1.P73 41,30.5 41.5,31 41.5,35.5 53.34,47.34 JP2.1
MSP_GPIO_2
  Top 0.254: JP2.2 50.8,45.55 41.25,36 39.25,36 38.75,35.5 38.75,34.25 33.25,28.75 25.25,28.75 24,27.5 U1.P9
MSP_GPIO_3  (via drill 0.4)
  Top 0.254: v42,4.5 42,12.75 41.25,13.5 34.5,13.5 32,16 U1.P41
  Bottom 0.406: v42,4.5 42.25,4.25 49.09,4.25 JP1.2
MSP_GPIO_4  (via drill 0.4)
  Top 0.254: v43,5.25 42.5,5.75 42.5,13 41.5,14 34.75,14 33,15.75 U1.P43
  Bottom 0.406: v43,5.25 50.63,5.25 JP1.1
MSP_SIMO
  Top 0.254: U1.P85 32,37.21 32.79,38 34.25,38 35,38.75 35,43 | JP2.5 43.18,47.18 42.5,46.5 37.5,46.5 35,44 35,43 | U4.5 34.91,42.91 35,43
MSP_SOMI
  Top 0.254: JP2.4 45.72,47.22 44,45.5 37.5,45.5 35.75,43.75 35.75,40.5 | U1.P84 32.5,37 33,37.5 34.5,37.5 35.75,38.75 35.75,40.5 | U4.2 35.88,40.37 35.75,40.5
N$1
  Top 0.406: R10.2 LED2.A
N$2
  Top 0.406: R11.2 LED1.A
N$5
  Top 0.254: 47.4,9.45 C8.2 | 61.65,5 U5.RING
  Top 0.406: R19.1 47.4,9.45 | C8.2 52,9.5 53,8.5 53,6.5 54.5,5 61.65,5
N$7
  Top 0.305: R12.1 18,23.46 JP4.2
N$11
  Top 0.254: U1.P54 39.5,21 40,20.5 40,19 TP1.P$1
N$19
  Top 0.254: 53.85,11.5 U5.TIP | 47.35,13.45 R20.1
  Top 0.406: 53.85,11.5 C7.1 47.35,13.45
NES_CLK  (via drill 0.41)
  Top 0.254: U1.P6 21,29 20.25,28.25 v20,28.25
  Top 0.406: U$2.P$2 11.45,8.95 12.5,10 12.5,28 11.5,29 11.5,32 12.5,33 12.5,35.2 U$3.P$2
  Bottom 0.406: U$2.P$2 11.45,8.95 15.5,13 15.5,25.75 18,28.25 v20,28.25
NES_DATA_1  (via drill 0.41)
  Top 0.254: U1.P4 20.25,30 v20,30.25
  Bottom 0.406: v20,30.25 17.5,30.25 11.5,24.25 11.5,18.5 U$2.P$4
NES_DATA_2  (via drill 0.41)
  Top 0.254: U1.P3 21,30.5 20.25,31.25 v20,31.25
  Bottom 0.406: U$3.P$4 13.5,42.2 13.5,35.25 17.5,31.25 v20,31.25
NES_LATCH  (via drill 0.41)
  Top 0.254: U1.P5 20.25,29.5 v20,29.25
  Top 0.406: U$2.P$3 9.55,12.95 8,14.5 8,39.7 U$3.P$3
  Bottom 0.406: U$2.P$3 11.45,12.95 13.5,15 13.5,25 17.75,29.25 v20,29.25
PROG_B  (via drill 0.4)
  Top 0.254: v24.5,31 U1.P100
  Bottom 0.406: JP4.1 20.25,26.75 v24.5,31
RED
  Top 0.406: R1.2 R2.2 R3.2 51.63,34 X1.1
RED_1
  Top 0.254: R1.1 45,38 42,35 42,30.75 41.25,30 U1.P72
RED_2
  Top 0.254: R2.1 45,36 42.5,33.5 42.5,30.5 41.5,29.5 U1.P71
RED_3
  Top 0.254: R3.1 45,34 43,32 43,30.25 41.75,29 U1.P70
TCK  (via drill 0.4)
  Top 0.254: U1.P76 36.6,33.6 v38,35
  Bottom 0.406: JP5.5 20.09,44.41 22,42.5 22,37.25 24.25,35 v38,35
TDI
  Top 0.254: JP5.2 20.21,36.79 21,36 21,31.5 21.5,31 U1.P2
TDO  (via drill 0.4)
  Top 0.254: U1.P75 38.6,31.73 v39.5,32.62
  Bottom 0.406: JP5.4 20.13,41.87 21,41 21,37 24,34 38.12,34 v39.5,32.62
TMS
  Top 0.254: U1.P1 22.25,31.5 22,31.75 22,37.5 20.17,39.33 JP5.3
VCC  (via drill 0.4)
  Top 0.254: U1.P26 24.5,18.5 24,19 v24,21 U1.P22 | U1.P45 34,20 34.5,20.5 35.5,20.5 36.5,21.5 U1.P55 40,21.5 41,20.5 v41,19 | U1.P67 36.25,27.5 v35.75,28 | v28.5,32 U1.P92 | v35,32 U1.P79 | v24,26.5 U1.P11 | JP1.10 30.5,2.56 | 23,10.5 23.05,10.55 | 23,7 TP3.P$1 | v26.5,32 U1.P96
  Top 0.406: U2.1 23.2,12.45 23,12.25 | 23,6.5 23,7 23,8.75 | 23,8.75 23,10.5 23,12.25 | 23,8.75 C5.1 25.9,9.6 25.45,10.05 U2.3 | 23,12.25 23,18 24,19 | U3.8 U3.7 | U4.8 U4.7
  Top 0.61: JP5.1 18.25,34.25 16.5,32.5 16.5,10.13 17.63,9 19,9 19.13,9.13 JP3.4 19.13,9 20.5,9 23,6.5 26.96,2.54 JP1.10 30.48,6.5 | QG1.4 28.65,45.15 v29,45.5 29.75,45.5 30.25,45 30.25,39.75 30.91,39.09 U4.8 | v41.5,41 40.87,41.63 U4.3 | 30.48,6.5 30.48,9.23 31.11,9.87 U3.3 | U3.8 40.59,12.4 41,12 41,8 39.5,6.5 30.48,6.5
  Bottom 0.406: JP3.4 15.13,9.13 13,7 7.95,7 U$2.P$7 3.5,11.45 3.5,17.5 6,20 U$3.P$7
  Bottom 0.61: v35,32 v28.5,32 v26.5,32 21.25,32 JP5.1 | v35,32 35,28.75 v35.75,28 | v41,19 41,8 38.5,5.5 33.44,5.5 JP1.10 | v35,32 37.5,32 38.5,31 40.5,31 41.5,32 v41.5,41 37,45.5 v29,45.5 | v24,21 23.5,21.5 23.5,26 v24,26.5
VCC_1.2V  (via drill 0.4, 0.41)
  Top 0.254: v34.75,27.5 35.25,27 U1.P66 39.9,27 C3.1 | C1.1 20.25,22.75 21,23.5 U1.P17 v24.75,23.5 | C2.1 29.4,14.9 30.5,16 U1.P38 | 27.6,14.25 C6.1 27.5,14.15 | v33.5,30.5 34,31 U1.P81 34,35 33.65,35.35 C4.1 | U2.5 29.05,12.45 29.5,12 29.5,7.75 TP2.P$1
  Top 0.406: U2.5 28.05,12.95 27.5,13.5 27.5,14.15 | 27.6,14.25 27.6,14.9 v27.5,15 | C6.1 C2.1 | C6.1
  Bottom 0.61: v27.5,15 27.5,20.75 v24.75,23.5 24.75,24.75 27.5,27.5 33,27.5 | 33,27.5 33.5,27.5 | 33.5,27.5 34,27.5 | 34,27.5 v34.75,27.5 | 33.5,27.5 33.5,28 | 33.5,28 v33.5,30.5 | 33,27.5 33.5,28 | 33.5,28 34,27.5
VSYNC
  Top 0.254: X1.14 58.03,27.47 59,26.5 59,23.5 58,22.5 50.5,22.5 48,20 45,20 42.5,22.5 U1.P57

### Text on the board
tNames: GND | http://bear24rw.blogspot.com | TCK | TDO | USER | TMS | FPGA JTAG | TDI | VCC | PROG_B | DONE | CS | MOSI | CLK | VCC | CONFIG | MISO | 3.3V | GND | 1.2V | LaunchPad GamingPack v1.1 | FPGA BITSTREAM PROM | GND